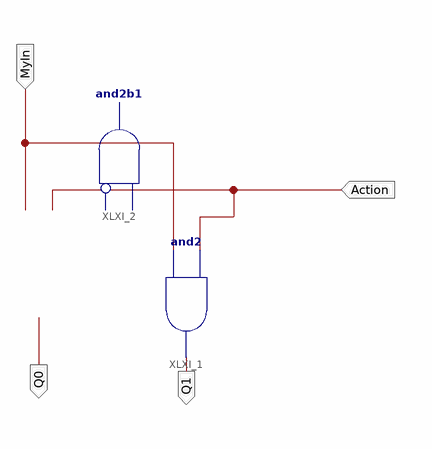
[diagram p0: schematic sheet 1]
// Xilinx ISE schematic ConditionalBlock.sch (spartan3a) as structural Verilog: 2 symbols, 4 ports
module ConditionalBlock (
  input  MyIn,
  input  Action,
  output Q0,
  output Q1
);

  and XLXI_1 (Q1, MyIn, Action);
  and XLXI_2 (Q0, ~Action, MyIn);  // and2b1
endmodule
